# Altium schematic sheet IO Peripherals.SchDoc
size A4; Revision: C.2(PCB.SCH)
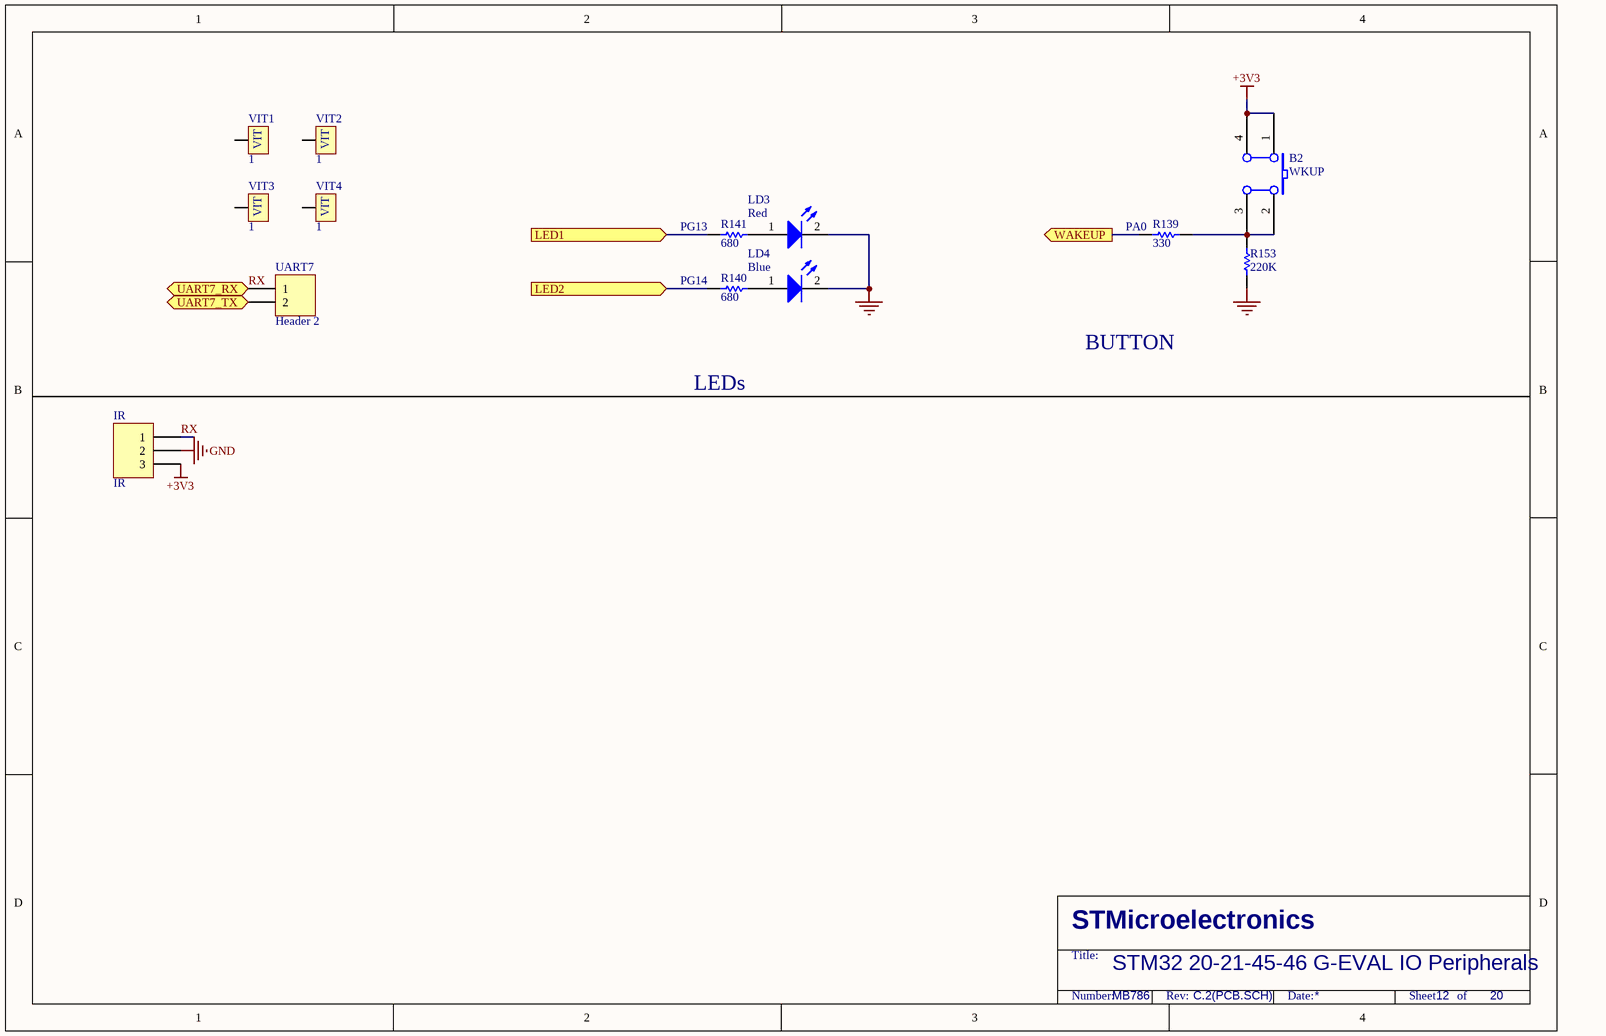
[diagram p0: IO Peripherals.SchDoc]

## Parts
B2  WKUP  [PB]
IR  IR  [HDR1X3]
LD3  Red  [0805_LED]
LD4  Blue  [0805_LED]
R139  330  [0603_R]
R140  680  [0603_R]
R141  680  [0603_R]
R153  220K  [0603_R]
UART7  Header 2  [HDR1X2]
VIT1  1  [VIT]
VIT2  1  [VIT]
VIT3  1  [VIT]
VIT4  1  [VIT]

## Ports
LED1 (in), LED2 (in), UART7_RX, UART7_TX, WAKEUP (out)

## Nets
+3V3: B2.1(A0) B2.4(A1) IR.3
GND: IR.2 LD3.2(K) LD4.2(K) R153.2
LED1: R141.2 ; port LED1
LED2: R140.2 ; port LED2
RX: IR.1 UART7.1 ; port UART7_RX
UART7_TX: UART7.2 ; port UART7_TX
WAKEUP: R139.2 ; port WAKEUP
NetB2_2: B2.2(B0) B2.3(B1) R139.1 R153.1
NetLD3_1: LD3.1(A) R141.1
NetLD4_1: LD4.1(A) R140.1

Not connected (* = marked no-connect by the designer): VIT1 VIT1(1); VIT2 VIT1(1); VIT3 VIT1(1); VIT4 VIT1(1)

## Notes on the sheet
- (near R141) PG13
- (near R139) PA0
- (near R140) PG14
- BUTTON
- LEDs
- STM32 20-21-45-46 G-EVAL IO Peripherals
- MB786
- 12
- 20
- STMicroelectronics
- Title:
- Number:
- Rev:
- Date:
- Sheet       of

## Library data of the parts
B2 = SW PUSHBUTTON: SE PUSHBUTTON
IR = Header 3: Header, 3-Pin; LatestRevisionDate: 17-Jul-2002; LatestRevisionNote: Re-released for DXP Platform.; Publisher: Altium Limited
LD3 LD4 = LED2: Typical RED, GREEN, YELLOW, AMBER GaAs LED; Published: 8-Jun-2000; Revision: July-2002: Re-released for DXP Platform.; Publisher: Altium Limited
R139-R141 = Res1: Resistor; Value: 1K; Published: 8-Jun-2000; Revision: July-2002: Re-released for DXP Platform.; Publisher: Altium Limited
R153 = res1: Resistor; Value: 1K; Published: 8-Jun-2000; Revision: July-2002: Re-released for DXP Platform.; Publisher: Altium Limited
UART7 = Header 2: Header, 2-Pin; LatestRevisionDate: 17-Jul-2002; LatestRevisionNote: Re-released for DXP Platform.; Publisher: Altium Limited
VIT1-VIT4 = VIT: Oc Vit